# EAGLE schematic RX_Mixer_Balanced_Modulator (EAGLE 5.07)
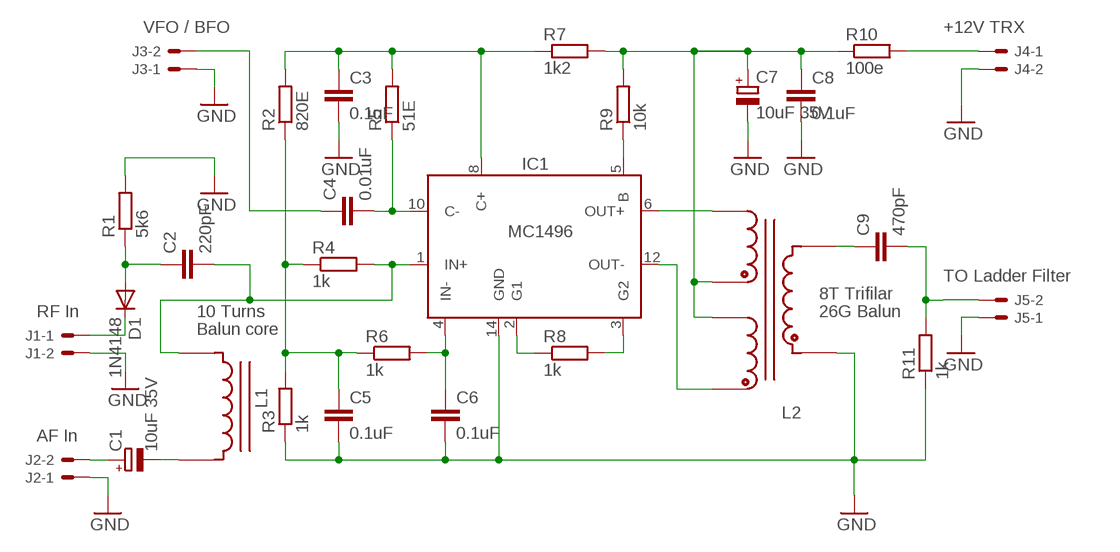
[diagram p0: schematic, sheet 1]

## Parts
C1  10uF 35V  CPOL-EUE2.5-6  [E2,5-6]
C2  220pF  C-EU050-035X075  [C050-035X075]
C3  0.1uF  C-EU050-035X075  [C050-035X075]
C4  0.01uF  C-EU050-035X075  [C050-035X075]
C5  0.1uF  C-EU050-035X075  [C050-035X075]
C6  0.1uF  C-EU050-035X075  [C050-035X075]
C7  10uF 35V  CPOL-EUE2.5-6  [E2,5-6]
C8  0.1uF  C-EU050-035X075  [C050-035X075]
C9  470pF  C-EU050-035X075  [C050-035X075]
D1  1N4148  1N4148DO35-10  [DO35-10]
IC1  MC1496  [MC1496]
J1  22-27-2021-02  [6410-02]
J2  22-27-2021-02  [6410-02]
J3  22-27-2021-02  [6410-02]
J4  22-27-2021-02  [6410-02]
J5  22-27-2021-02  [6410-02]
L1  T37  T37_INDUCTOR  [T37_INDUCTOR]
L2  T50  T50_TRIFILAR_TRANSFORMER  [T50_TRIFILAR_TRANSFORMER]
R1  5k6  R-EU_0207/10  [0207/10]
R2  820E  R-EU_0207/10  [0207/10]
R3  1k  R-EU_0207/10  [0207/10]
R4  1k  R-EU_0207/10  [0207/10]
R5  51E  R-EU_0207/10  [0207/10]
R6  1k  R-EU_0207/10  [0207/10]
R7  1k2  R-EU_0207/10  [0207/10]
R8  1k  R-EU_0207/10  [0207/10]
R9  10k  R-EU_0207/10  [0207/10]
R10  100e  R-EU_0207/10  [0207/10]
R11  1k  R-EU_0207/10  [0207/10]

## Nets
GND: C3.2 C5.2 C6.2 C7.- C8.2 IC1.14(GND) J1.2 J2.1 J3.1 J4.2 J5.1 L2.C1B R1.2 R3.1 R11.1
N$1: C2.2 IC1.1(IN+) L1.CA R4.2
N$2: C4.2 IC1.10(C-) R5.1
N$3: C3.1 IC1.8(C+) R2.2 R5.2 R7.1
N$4: C7.+ C8.1 L2.C2A L2.C3B R7.2 R9.2 R10.1
N$5: IC1.5(B) R9.1
N$6: IC1.3(G2) R8.2
N$7: IC1.2(G1) R8.1
N$8: C6.1 IC1.4(IN-) R6.2
N$9: C5.1 R2.1 R3.2 R4.1 R6.1
N$10: C4.1 J3.2
N$11: C9.2 J5.2 R11.2
N$12: C2.1 D1.A R1.1
N$13: IC1.6(OUT+) L2.C3A
N$14: IC1.12(OUT-) L2.C2B
N$15: C9.1 L2.C1A
N$16: C1.- L1.CB
N$17: J4.1 R10.2
N$18: D1.C J1.1
N$19: C1.+ J2.2

## Notes on the sheet
- VFO / BFO | +12V TRX
- TO Ladder Filter
- 8T Trifilar
- RF In | 10 Turns | 26G Balun
- Balun core
- AF In

## Library data of the parts
C1 C7 = rcl:CPOL-EU: POLARIZED CAPACITOR, European symbol
C2-C6 C8 C9 = rcl:C-EU: CAPACITOR, European symbol
D1 = diode:1N4148: DIODE high speed (Philips)
IC1 = MC1496:MC1496: MC1496
J1-J5 = con-molex:22-?-02: CONNECTOR wire to board 2.54 mm (.1 inch) pitch header
L1 = toroid:T37_INDUCTOR: Inductor wound on a T37 Toroid
L2 = toroid:T50_TRIFILAR_TRANSFORMER: Transformer (having 3 windings) on a T50 Toroid
R1-R11 = rcl:R-EU_: RESISTOR, European symbol